# Altium project loz-old-man.PrjPcb (part 1 of 5)
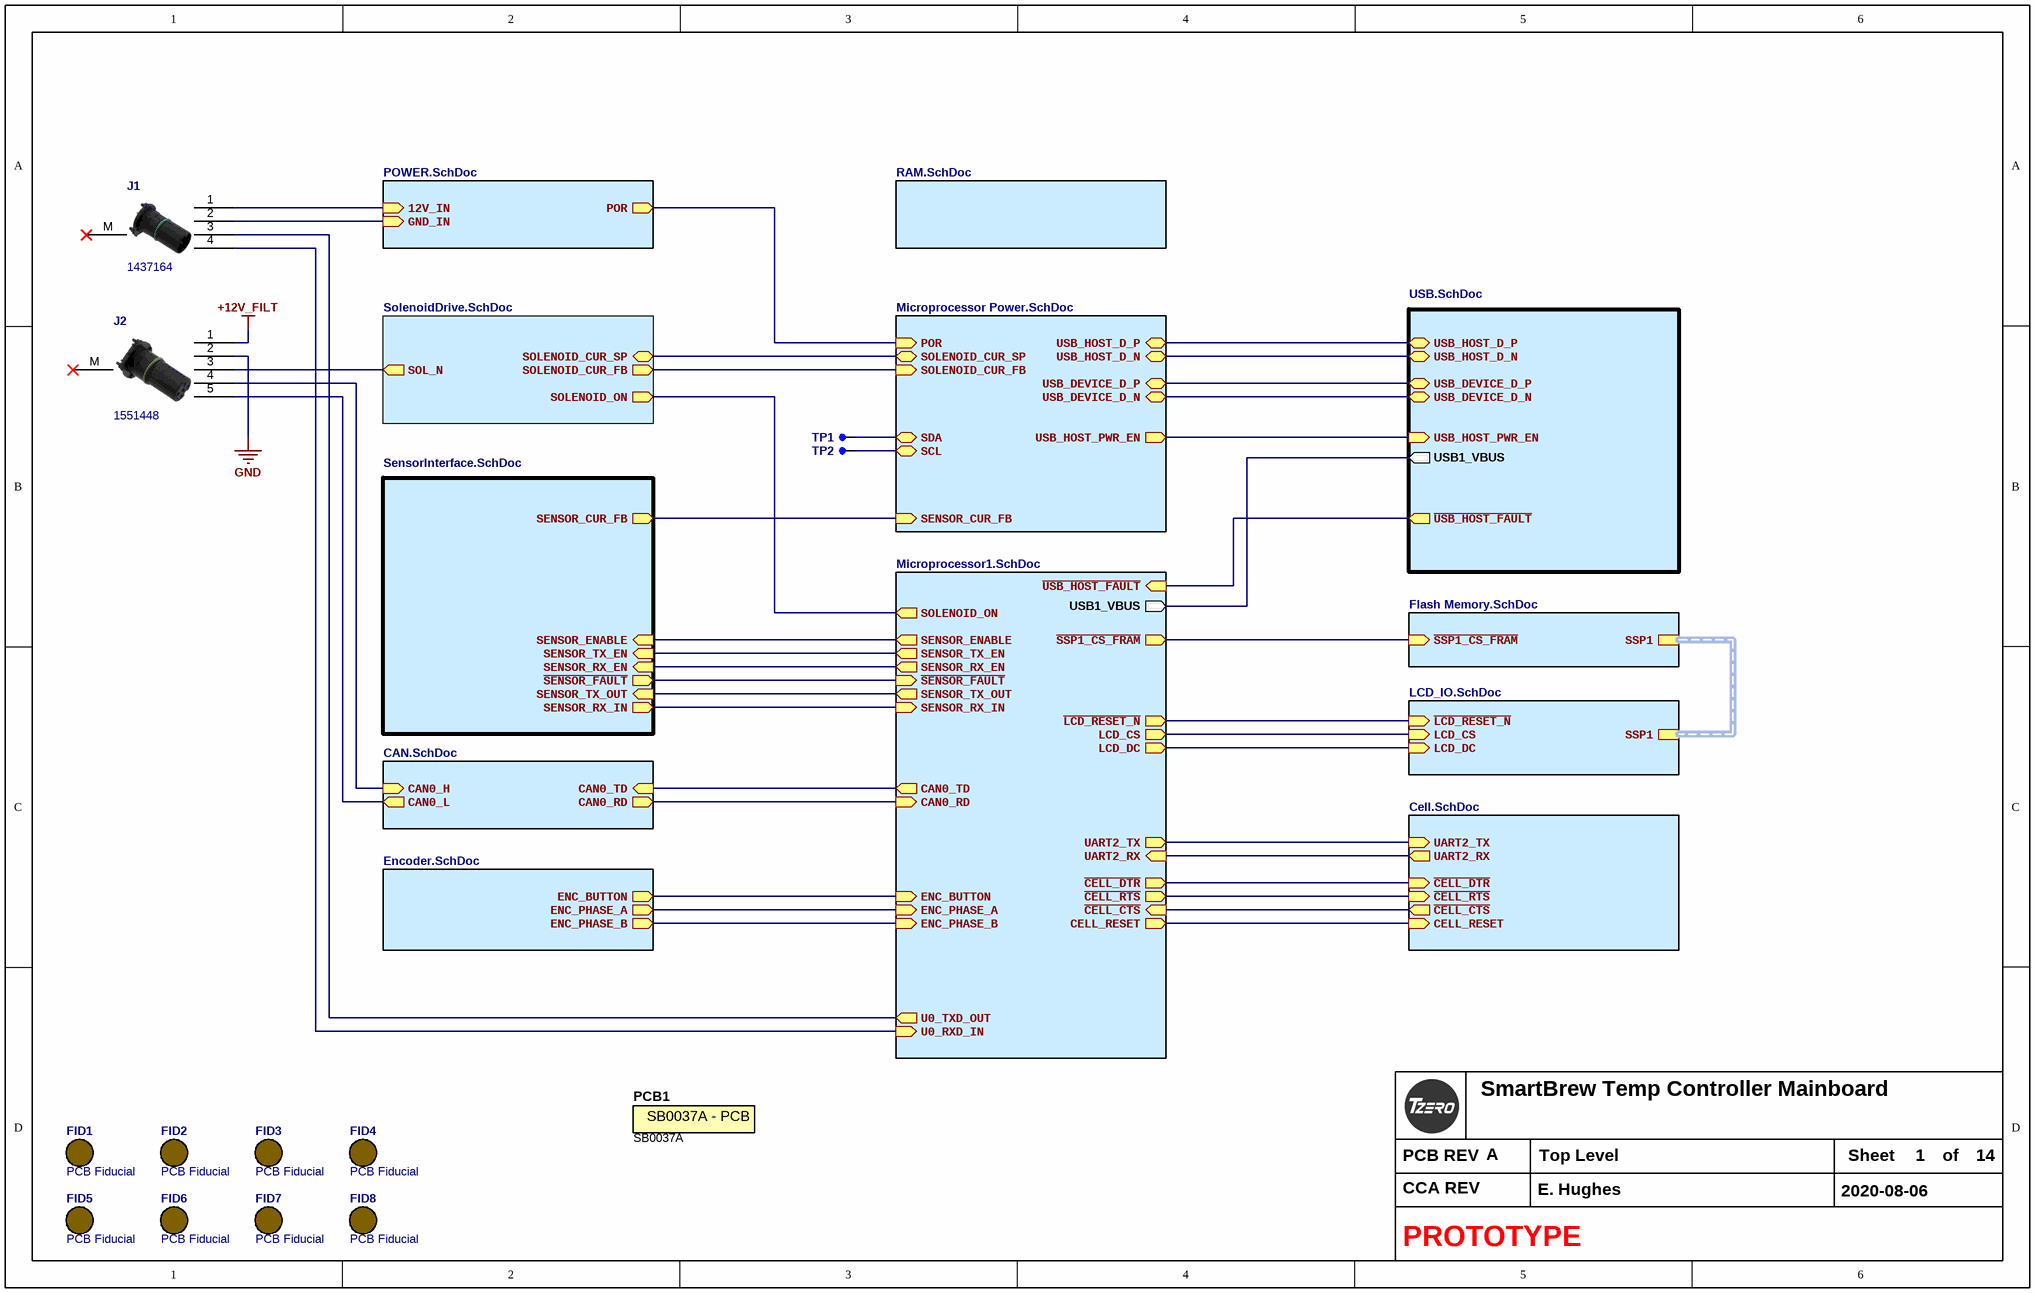
[diagram p0: TOP_LEVEL.SchDoc]
APPROVAL_APPROVED_1: -; APPROVAL_APPROVED_1_DATE: -; APPROVAL_APPROVED_2: -; APPROVAL_APPROVED_2_DATE: -; APPROVAL_CHECKED_DATE: -; APPROVAL_DRAWN: -; APPROVAL_DRAWN_DATE: -; APPROVAL_ENGINEER: -; APPROVAL_ENGINEER_DATE: -; APPROVAL_REVIEWED: -; APPROVAL_REVIEWED_DATE: -; BOM_NOTES_LINE_1: -; BOM_NOTES_LINE_2: -; BOM_NOTES_LINE_3: -; BOM_NOTES_LINE_4: -; CCA_PART_NUMBER: SB0036; CCA_TITLE: SmartBrew Temp Controller Mainboard; PCB_COPPER_WEIGHT_INNER: 1 oz; PCB_COPPER_WEIGHT_OUTER: 1 oz; PCB_DIMENSION_X: X; PCB_DIMENSION_Y: X; PCB_DRC_DATE: X; PCB_FINISH_PLATING: GOLD ENIG; PCB_FINISHED_THICKNESS: 62.5mil; PCB_LAYERS: 4; PCB_MATERIAL: FR4; PCB_MIN_DRILL: 10mil; PCB_MIN_TRACE_SPACE: 6mil; PCB_MIN_TRACE_WIDTH: 6mil; PCB_PART_NUMBER: SB0037; PCB_PRINTOUT_SCALE: 1:1; PCB_SILKSCREEN_COLOR_BOTTOM: WHITE; PCB_SILKSCREEN_COLOR_TOP: WHITE; PCB_SOLDER_MASK_COLOR_BOTTOM: BLUE; PCB_SOLDER_MASK_COLOR_TOP: BLUE; PCB_TITLE: SmartBrew Temp Controller Mainboard; PCB_VERSION: A; PROJECT_ENGINEER: E. Hughes; PROJECT_STATUS: PROTOTYPE; PROJECT_TITLE_LINE_1: SmartBrew Temp Controller Mainboard; SCH_DATE: 2020-08-06
13 sheets, 283 parts. Net scope: hierarchical (ports join the sheet entries above them; power ports are global).
Board file: SB0037A.PcbDoc
Sheets:
  TOP_LEVEL.SchDoc
    U_SolenoidDrive = SolenoidDrive.SchDoc
    U_Cell = Cell.SchDoc
    U_LCD_IO = LCD_IO.SchDoc
    U_SensorInterface = SensorInterface.SchDoc
    U_Encoder = Encoder.SchDoc
    U_POWER = POWER.SchDoc
    U_RAM = RAM.SchDoc
    U_CAN = CAN.SchDoc
    U_Microprocessor1 = Microprocessor1.SchDoc
    U_Microprocessor Power = Microprocessor Power.SchDoc
    U_Flash Memory = Flash Memory.SchDoc
    U_USB = USB.SchDoc

## Sheet TOP_LEVEL.SchDoc
size B; DocumentNumber: 1; SheetNumber: 1; SheetTotal: 14; PAGE_TITLE: Top Level

### Parts
FID1  PCB Fiducial  [Fiducial 1mm - 2mm]  (no BOM)
FID2  PCB Fiducial  [Fiducial 1mm - 2mm]  (no BOM)
FID3  PCB Fiducial  [Fiducial 1mm - 2mm]  (no BOM)
FID4  PCB Fiducial  [Fiducial 1mm - 2mm]  (no BOM)
FID5  PCB Fiducial  [Fiducial 1mm - 2mm]  (no BOM)
FID6  PCB Fiducial  [Fiducial 1mm - 2mm]  (no BOM)
FID7  PCB Fiducial  [Fiducial 1mm - 2mm]  (no BOM)
FID8  PCB Fiducial  [Fiducial 1mm - 2mm]  (no BOM)
J1  1437164  [1437164]
J2  1551448  [1551448]
PCB1  SB0037A  (mechanical)
TP1  (no value)  [TP_SMT_25_MIL_ROUND]  (net tie, no BOM)
TP2  (no value)  [TP_SMT_25_MIL_ROUND]  (net tie, no BOM)

### Sub-sheets
U_CAN = CAN.SchDoc: CAN0_RD (out), CAN0_TD (in), CAN0_L (out), CAN0_H (in)
U_Cell = Cell.SchDoc: UART2_TX (in), CELL_RESET (in), UART2_RX (out), ~{CELL_DTR} (in), ~{CELL_RTS} (in), ~{CELL_CTS} (out)
U_Encoder = Encoder.SchDoc: ENC_BUTTON (out), ENC_PHASE_A (out), ENC_PHASE_B (out)
U_Flash Memory = Flash Memory.SchDoc: ~{SSP1_CS_FRAM} (in), SSP1 (harness SSP1)
U_LCD_IO = LCD_IO.SchDoc: SSP1 (harness SSP1), ~{LCD_RESET_N} (in), LCD_CS (in), LCD_DC (in)
U_Microprocessor1 = Microprocessor1.SchDoc: LCD_DC (out), SENSOR_RX_EN (out), SOLENOID_ON (out), ~{SENSOR_FAULT} (in), SENSOR_ENABLE (out), SENSOR_TX_EN (out), SENSOR_TX_OUT (out), CAN0_TD (out), UART2_TX (out), SENSOR_RX_IN (in), ~{LCD_RESET_N} (out), UART2_RX (in), LCD_CS (out), ~{SSP1_CS_FRAM} (out), CAN0_RD (in), ENC_PHASE_B (in), ENC_PHASE_A (in), ENC_BUTTON (in), CELL_RESET (out), ~{CELL_DTR} (out), ~{CELL_RTS} (out), ~{CELL_CTS} (in), ~{USB_HOST_FAULT} (in), U0_RXD_IN (in), U0_TXD_OUT (out), USB1_VBUS (out)
U_Microprocessor Power = Microprocessor Power.SchDoc: SOLENOID_CUR_SP (bidir), SOLENOID_CUR_FB (in), USB_HOST_PWR_EN (out), SCL (bidir), SDA (bidir), POR (in), USB_DEVICE_D_P (bidir), USB_HOST_D_P (bidir), USB_DEVICE_D_N (bidir), USB_HOST_D_N (bidir), SENSOR_CUR_FB (in)
U_POWER = POWER.SchDoc: POR (out), 12V_IN (in), GND_IN (in)
U_RAM = RAM.SchDoc: no entries
U_SensorInterface = SensorInterface.SchDoc: SENSOR_TX_EN (in), SENSOR_ENABLE (in), ~{SENSOR_FAULT} (out), SENSOR_RX_IN (out), SENSOR_TX_OUT (in), SENSOR_RX_EN (in), SENSOR_CUR_FB (out)
U_SolenoidDrive = SolenoidDrive.SchDoc: SOLENOID_ON (out), SOLENOID_CUR_FB (out), SOLENOID_CUR_SP (bidir), SOL_N (out)
U_USB = USB.SchDoc: USB_HOST_D_P (bidir), USB_HOST_D_N (bidir), ~{USB_HOST_FAULT} (out), USB_HOST_PWR_EN (in), USB_DEVICE_D_P (bidir), USB_DEVICE_D_N (bidir), USB1_VBUS (out)

### Nets
+12V_FILT: J2.1
GND: J2.2
12V_IN: J1.1 ; sheet U_POWER/12V_IN
~{CELL_CTS}: sheet U_Cell/~{CELL_CTS}, sheet U_Microprocessor1/~{CELL_CTS}
~{CELL_DTR}: sheet U_Cell/~{CELL_DTR}, sheet U_Microprocessor1/~{CELL_DTR}
~{CELL_RTS}: sheet U_Cell/~{CELL_RTS}, sheet U_Microprocessor1/~{CELL_RTS}
~{LCD_RESET_N}: sheet U_LCD_IO/~{LCD_RESET_N}, sheet U_Microprocessor1/~{LCD_RESET_N}
~{SENSOR_FAULT}: sheet U_SensorInterface/~{SENSOR_FAULT}, sheet U_Microprocessor1/~{SENSOR_FAULT}
~{SSP1_CS_FRAM}: sheet U_Microprocessor1/~{SSP1_CS_FRAM}, sheet U_Flash Memory/~{SSP1_CS_FRAM}
~{USB_HOST_FAULT}: sheet U_Microprocessor1/~{USB_HOST_FAULT}, sheet U_USB/~{USB_HOST_FAULT}
CAN0_H: J2.4 ; sheet U_CAN/CAN0_H
CAN0_L: J2.5 ; sheet U_CAN/CAN0_L
CAN0_RD: sheet U_CAN/CAN0_RD, sheet U_Microprocessor1/CAN0_RD
CAN0_TD: sheet U_CAN/CAN0_TD, sheet U_Microprocessor1/CAN0_TD
CELL_RESET: sheet U_Cell/CELL_RESET, sheet U_Microprocessor1/CELL_RESET
ENC_BUTTON: sheet U_Encoder/ENC_BUTTON, sheet U_Microprocessor1/ENC_BUTTON
ENC_PHASE_A: sheet U_Encoder/ENC_PHASE_A, sheet U_Microprocessor1/ENC_PHASE_A
ENC_PHASE_B: sheet U_Encoder/ENC_PHASE_B, sheet U_Microprocessor1/ENC_PHASE_B
GND_IN: J1.2 ; sheet U_POWER/GND_IN
LCD_CS: sheet U_LCD_IO/LCD_CS, sheet U_Microprocessor1/LCD_CS
LCD_DC: sheet U_LCD_IO/LCD_DC, sheet U_Microprocessor1/LCD_DC
POR: sheet U_POWER/POR, sheet U_Microprocessor Power/POR
SCL: TP2.1 ; sheet U_Microprocessor Power/SCL
SDA: TP1.1 ; sheet U_Microprocessor Power/SDA
SENSOR_CUR_FB: sheet U_SensorInterface/SENSOR_CUR_FB, sheet U_Microprocessor Power/SENSOR_CUR_FB
SENSOR_ENABLE: sheet U_SensorInterface/SENSOR_ENABLE, sheet U_Microprocessor1/SENSOR_ENABLE
SENSOR_RX_EN: sheet U_SensorInterface/SENSOR_RX_EN, sheet U_Microprocessor1/SENSOR_RX_EN
SENSOR_RX_IN: sheet U_SensorInterface/SENSOR_RX_IN, sheet U_Microprocessor1/SENSOR_RX_IN
SENSOR_TX_EN: sheet U_SensorInterface/SENSOR_TX_EN, sheet U_Microprocessor1/SENSOR_TX_EN
SENSOR_TX_OUT: sheet U_SensorInterface/SENSOR_TX_OUT, sheet U_Microprocessor1/SENSOR_TX_OUT
SOL_N: J2.3 ; sheet U_SolenoidDrive/SOL_N
SOLENOID_CUR_FB: sheet U_SolenoidDrive/SOLENOID_CUR_FB, sheet U_Microprocessor Power/SOLENOID_CUR_FB
SOLENOID_CUR_SP: sheet U_SolenoidDrive/SOLENOID_CUR_SP, sheet U_Microprocessor Power/SOLENOID_CUR_SP
SOLENOID_ON: sheet U_SolenoidDrive/SOLENOID_ON, sheet U_Microprocessor1/SOLENOID_ON
U0_RXD_IN: J1.4 ; sheet U_Microprocessor1/U0_RXD_IN
U0_TXD_OUT: J1.3 ; sheet U_Microprocessor1/U0_TXD_OUT
UART2_RX: sheet U_Cell/UART2_RX, sheet U_Microprocessor1/UART2_RX
UART2_TX: sheet U_Cell/UART2_TX, sheet U_Microprocessor1/UART2_TX
USB1_VBUS: sheet U_Microprocessor1/USB1_VBUS, sheet U_USB/USB1_VBUS
USB_DEVICE_D_N: sheet U_Microprocessor Power/USB_DEVICE_D_N, sheet U_USB/USB_DEVICE_D_N
USB_DEVICE_D_P: sheet U_Microprocessor Power/USB_DEVICE_D_P, sheet U_USB/USB_DEVICE_D_P
USB_HOST_D_N: sheet U_Microprocessor Power/USB_HOST_D_N, sheet U_USB/USB_HOST_D_N
USB_HOST_D_P: sheet U_Microprocessor Power/USB_HOST_D_P, sheet U_USB/USB_HOST_D_P
USB_HOST_PWR_EN: sheet U_Microprocessor Power/USB_HOST_PWR_EN, sheet U_USB/USB_HOST_PWR_EN

Not connected (* = marked no-connect by the designer): J1 M*; J2 M*

### Buses and harness runs
harness sheet U_Flash Memory/SSP1 = sheet U_LCD_IO/SSP1

### Notes on the sheet
- PCB REV
- Sheet
- of
- CCA REV
- (in symbol SB0037A) SB0037A - PCB

### Library data of the parts
FID1-FID8 = Fiducial: Value: PCB Fiducial
J1 = 1437164: Circular Metric Connectors SACC-CI-M12MS- 4CON-L180 THR; Manufacturer: Phoenix Contact; Current Rating: 4A; Voltage Rating: 250V; Number of Contacts: 4; Connector Type: Plug; Gender: Female; Strain Relief: No (Without); Number of Ports: 1; Thread Size: M12; Ratings: IP67,Waterproof,Dust Tight; Value: 1437164; Supplier 1: Digi-Key; Manufacturer Part Number: 1437164; Stock 1: 71; Pricing 1: 1=6.15000, 10=5.88500, 50=5.72500, 100=5.35040, 250=4.92240, 500=4.54784, 1000=4.33387, 2500=3.87875 (USD); RoHS: Yes; Mount: Through Hole; Contact Material: Brass; Contact Plating: Gold; Housing Material: Polyamide; Number of Terminals: 4; Min Operating Temperature: -25°C; Max Operating Temperature: 85°C; Packaging: Tray; Max Current Rating: 4A; Termination: Solder; Package Quantity: 60; Contact Gender: Male; Number of Positions: 4; Orientation: Straight; Fastening Type: Threaded; ComponentLink1URL: https://datasheet.ciiva.com/16136/1437164-16136065.pdf?src-supplier=Onlinecomponents.com; ComponentLink1Description: https://datasheet.ciiva.com/16136/1437164-16136065.pdf?src-supplier=Onlinecomponents.com; ComponentLink2URL: https://datasheet.ciiva.com/29256/586130-da-01-en-sens-akt-einbaust-4pol-1437164-60-st-29256645.pdf?src-supplier=Conrad; ComponentLink2Description: https://datasheet.ciiva.com/29256/586130-da-01-en-sens-akt-einbaust-4pol-1437164-60-st-29256645.pdf?src-supplier=Conrad; Supplier Part Number 1: 277-13184-ND
J2 = 1551448: Flush-type connector SACC-CI-M12FS-5CON-L180-THR 1551448 Phoenix Contact; Plating: Polyamide; Number of Positions: 5; Current Rating: 4A; Voltage Rating: 60V; Connector Type: Receptacle; Number of Ports: 1; Thread Size: M12; Ratings: IP67,Waterproof,Dust Tight; Value: 1551448; Supplier 1: Digi-Key; Supplier Part Number 1: 277-13414-ND; Manufacturer: Phoenix Contact; Manufacturer Part Number: 1551448; Stock: 70; Pricing: 1=8.12, 10=7.771, 50=7.5588, 100=7.0642, 250=6.4991, 500=6.0046, 1000=5.722, 2500=5.3688 (USD); RoHS: Yes; Mount: Through Hole; Weight: 0.123459oz; Contact Plating: Gold; Contact Material: Brass; Number of Terminals: 5; Min Operating Temperature: -25°C; Max Operating Temperature: 85°C; Packaging: Tray; Number of Contacts: 5; Contact Gender: Female; Termination: Solder; Package Quantity: 60; Fastening Type: Threaded; Orientation: Straight; Max Current Rating: 4A; Lead Free: Lead Free; ComponentLink1URL: https://datasheet.ciiva.com/618/1551448-618993.pdf?src-supplier=Digi-Key; ComponentLink1Description: https://datasheet.ciiva.com/618/1551448-618993.pdf?src-supplier=Digi-Key; ComponentLink2URL: https://datasheet.ciiva.com/24433/1551448-24433704.pdf?src-supplier=Onlinecomponents.com; ComponentLink2Description: https://datasheet.ciiva.com/24433/1551448-24433704.pdf?src-supplier=Onlinecomponents.com; ComponentLink3URL: https://datasheet.ciiva.com/29259/719975-da-01-en-sens-akt-einbaubuch-5pol-1551448-60-st-29259372.pdf?src-supplier=Conrad; ComponentLink3Description: https://datasheet.ciiva.com/29259/719975-da-01-en-sens-akt-einbaubuch-5pol-1551448-60-st-29259372.pdf?src-supplier=Conrad
PCB1 = SB0037A: SB0037 Temp Controller Raw PCB Rev A; Manufacturer: TZero; Manufacturer Part Number: SB0024B; Value: SB0037A
TP1 TP2 = TP SMT 25MIL: Sort Value: *; Category: *; CategorySort: *

## Sheet SolenoidDrive.SchDoc
size B; DocumentNumber: 3; SheetNumber: 3; SheetTotal: 14; PAGE_TITLE: -
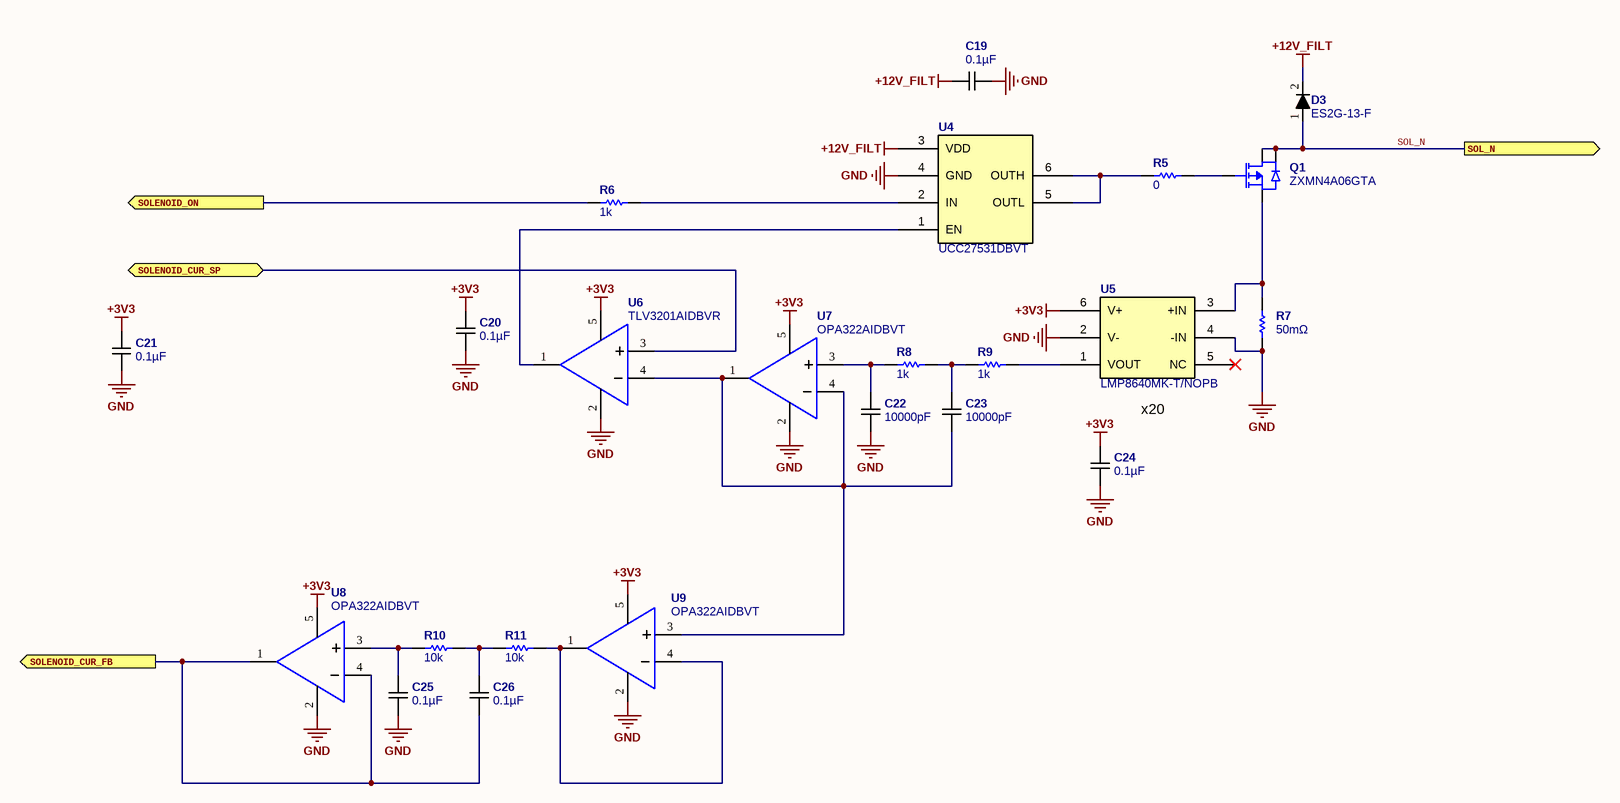
[diagram p1: SolenoidDrive.SchDoc]

### Parts
C19  0.1µF  [C0402_0.55MM_HD]
C20  0.1µF  [C0402_0.55MM_HD]
C21  0.1µF  [C0402_0.55MM_HD]
C22  10000pF  [C0603_0.90MM_HD]
C23  10000pF  [C0603_0.90MM_HD]
C24  0.1µF  [C0402_0.55MM_HD]
C25  0.1µF  [C0402_0.55MM_HD]
C26  0.1µF  [C0402_0.55MM_HD]
D3  ES2G-13-F  [D_SMB_P]
Q1  ZXMN4A06GTA  [SOT223]
R5  0  [R0603_0.55MM_MD]
R6  1k  [R0603_0.55MM_MD]
R7  50mΩ  [R1206_0.60MM_HD]
R8  1k  [R0603_0.55MM_MD]
R9  1k  [R0603_0.55MM_MD]
R10  10k  [R0603_0.55MM_MD]
R11  10k  [R0603_0.55MM_MD]
U4  UCC27531DBVT  [SOT95P245X145-6L]
U5  LMP8640MK-T/NOPB  [SOT95P245X145-6L]
U6  TLV3201AIDBVR  [SOT23-5]
U7  OPA322AIDBVT  [SOT23-5]
U8  OPA322AIDBVT  [SOT23-5]
U9  OPA322AIDBVT  [SOT23-5]

### Ports
SOL_N (out), SOLENOID_CUR_FB (out), SOLENOID_CUR_SP (bidir), SOLENOID_ON (out)

### Nets
+3V3: C20.1 C21.1 C24.1 U5.6(V+) U6.5(VCC) U7.5(VCC) U8.5(VCC) U9.5(VCC)
+12V_FILT: C19.1 D3.2(K) U4.3(VDD)
GND: C19.2 C20.2 C21.2 C22.1 C24.2 C25.2 R7.1 U4.4(GND) U5.2(V-) U5.4(-IN) U6.2(GND) U7.2(GND) U8.2(GND) U9.2(GND)
SOL_N: D3.1(A) Q1.2(D) Q1.4(D) ; port SOL_N
SOLENOID_CUR_FB: C26.2 U8.1(OUT) U8.4(-) ; port SOLENOID_CUR_FB
SOLENOID_CUR_SP: U6.3(+) ; port SOLENOID_CUR_SP
SOLENOID_ON: R6.1 ; port SOLENOID_ON
NetC22_2: C22.2 R8.2 U7.3(+)
NetC23_1: C23.1 U6.4(-) U7.1(OUT) U7.4(-) U9.3(+)
NetC23_2: C23.2 R8.1 R9.2
NetC25_1: C25.1 R10.2 U8.3(+)
NetC26_1: C26.1 R10.1 R11.2
NetQ1_1: Q1.1(G) R5.1
NetQ1_3: Q1.3(S) R7.2 U5.3(+IN)
NetR5_2: R5.2 U4.5(OUTL) U4.6(OUTH)
NetR6_2: R6.2 U4.2(IN)
NetR9_1: R9.1 U5.1(VOUT)
NetR11_1: R11.1 U9.1(OUT) U9.4(-)
NetU4_1: U4.1(EN) U6.1(OUT)

Not connected (* = marked no-connect by the designer): U5 5(NC)*

### Notes on the sheet
- x20
- PCB REV
- Sheet
- of
- CCA REV

### Library data of the parts
C19-C21 C24-C26 = CGA2B3X7R1E104K050BB: CAP CER 0.1UF 25V X7R 0402; Manufacturer: TDK Corporation; Tolerance: ±10%; Substitution Notes: 0.1µF , 25V , ±10% , X7R , -55°C ~ 125°C , AEC-Q200 , 0402; Value: 0.1µF; Temperature Coefficient: X7R; Manufacturer Part Number: CGA2B3X7R1E104K050BB; ComponentLink1Description: Datasheet (Internal); ComponentLink1URL: datasheets\TDK\mlcc_automotive_general_en.pdf; ComponentLink2Description: Datasheet (External); ComponentLink2URL: https://product.tdk.com/info/en/catalog/datasheets/mlcc_automotive_general_en.pdf; Supplier 1: Digikey; Supplier Part Number 1: 445-6902-1-ND; Category: Capacitors; Voltage - Rated: 25V; Features: -; Operating Temperature: -55°C ~ 125°C; Ratings: AEC-Q200; Package: 0402; Thickness (Max): 0.55MM
C22 C23 = CGA3E2C0G1H103J080AA: CAP CER 10000PF 50V C0G 0603; Manufacturer: TDK Corporation; Temperature Coefficient: C0G, NP0; Tolerance: ±5%; Substitution Notes: 10000pF , 50V , ±5% , C0G, NP0 , -55°C ~ 125°C , AEC-Q200 , 0603; Value: 10000pF; Manufacturer Part Number: CGA3E2C0G1H103J080AA; ComponentLink1Description: Datasheet (Internal); ComponentLink1URL: datasheets\TDK\mlcc_automotive_general_en.pdf; ComponentLink2Description: Datasheet (External); ComponentLink2URL: https://product.tdk.com/info/en/catalog/datasheets/mlcc_automotive_general_en.pdf; Supplier 1: Digikey; Supplier Part Number 1: 445-6916-1-ND; Category: Capacitors; Voltage - Rated: 50V; Features: -; Operating Temperature: -55°C ~ 125°C; Ratings: AEC-Q200; Package: 0603; Thickness (Max): 0.90MM
D3 = ES2G-13-F: DIODE SUPER FAST 2A 400V SMB; Manufacturer: Diodes Inc; CategorySort: 400; Diode Type: Standard; Voltage - Forward (Vf) (Max) @ If: 1.25V @ 2A; Speed: Fast Recovery =< 500ns- > 200mA (Io); Reverse Recovery Time (trr): 35ns; Current - Reverse Leakage @ Vr: 5µA @ 400V; Capacitance @ Vr- F: 25pF @ 4V- 1MHz; Num Pins: 2; Diode Suffix: 1A_2C; Category: Diodes; Value: ES2G-13-F; Manufacturer Part Number: ES2G-13-F; ComponentLink1Description: Internal Datasheet; ComponentLink1URL: http://www.diodes.com/datasheets/ds30212.pdf; ComponentLink2Description: External Datasheet; ComponentLink2URL: http://www.diodes.com/datasheets/ds30212.pdf; Supplier 1: Digi-Key; Supplier Part Number 1: ES2G-FDICT-ND; SortValue: ES2G-13-F; Voltage - DC Reverse (Vr) (Max): 400V; Current - Average Rectified (Io): 2A; Mounting Type: Surface Mount; Package: DO-214AA- SMB; Supplier Device Package: SMB; Packaging: Cut Tape (CT)
Q1 = ZXMN4A06GTA: Trans MOSFET N-CH 40V 7A 4-Pin(3+Tab) SOT-223 T/R; Manufacturer: Diodes Zetex; Rise Time: 4.45ns; Gate to Source Voltage (Vgs): 20V; Fall Time: 7.35ns; Turn-Off Delay Time: 28.61ns; Turn-On Delay Time: 2.55ns; Max Power Dissipation: 3.9W; Rds On Max: 50mR; Input Capacitance: 770pF; Number of Elements: 1; Drain to Source Resistance: 75mR; Threshold Voltage: 1V; Element Configuration: Single; Current Rating: 6.7A; Value: ZXMN4A06GTA; Supplier 1: Digi-Key; Manufacturer Part Number: ZXMN4A06GTA; Stock 1: 50125; Pricing 1: 1=0.84000, 10=0.73900, 100=0.50380, 500=0.42096 (USD); RoHS: Yes; Mount: Surface Mount; Case/Package: SOT-223; Number of Pins: 4; Weight: 0.000282oz; Min Operating Temperature: -55°C; Max Operating Temperature: 150°C; Continuous Drain Current (ID): 7A; Packaging: Tape and Reel; Package Quantity: 1000; Drain to Source Voltage (Vdss): 40V; Drain to Source Breakdown Voltage: 40V; Power Dissipation: 3.9W; Voltage Rating (DC): 40V; Number of Channels: 1; On-State Resistance: 75mR; Length: 6.7mm; Height: 1.65mm; Width: 3.7mm; Radiation Hardening: No; REACH SVHC: No SVHC; Lead Free: Lead Free; ComponentLink1URL: https://datasheet.ciiva.com/16509/zxmn4a06g-16509072.pdf?src-supplier=Future+Electronics; ComponentLink1Description: https://datasheet.ciiva.com/16509/zxmn4a06g-16509072.pdf?src-supplier=Future+Electronics; ComponentLink2URL: https://datasheet.ciiva.com/11176/zxmn4a06g-11176340.pdf?src-supplier=Avnet; ComponentLink2Description: https://datasheet.ciiva.com/11176/zxmn4a06g-11176340.pdf?src-supplier=Avnet; ComponentLink3URL: https://datasheet.ciiva.com/26816/getdatasheetpartid-86229-26816612.pdf?src-supplier=Verical; ComponentLink3Description: https://datasheet.ciiva.com/26816/getdatasheetpartid-86229-26816612.pdf?src-supplier=Verical; ComponentLink4URL: https://datasheet.ciiva.com/5775/44098-5775224.pdf?src-supplier=Farnell; ComponentLink4Description: https://datasheet.ciiva.com/5775/44098-5775224.pdf?src-supplier=Farnell; ComponentLink5URL: https://datasheet.ciiva.com/11174/zxmn4a06g-11174983.pdf?src-supplier=Avnet; ComponentLink5Description: https://datasheet.ciiva.com/11174/zxmn4a06g-11174983.pdf?src-supplier=Avnet; Supplier Part Number 1: ZXMN4A06GCT-ND
R5 = ERJ-3GEY0R00V: RES 0.0 OHM 1/10W JUMP 0603 SMD; Manufacturer: Panasonic Electronic Components; Package Power: 0603  (0.1W); Power (Watts): 0.1W- 1/10W; Tolerance: Jumper; Limiting Element Voltage: 75; Maximum Overload Voltage: 150; Maximum Working Voltage: 0.0V; Substitution Notes: 0 , Jumper , 0603 , AEC-Q200; Value: 0; Manufacturer Part Number: ERJ-3GEY0R00V; ComponentLink1Description: Internal Datasheet; ComponentLink1URL: datasheets\Panasonic Electronic Components\AOA0000CE1.pdf; ComponentLink2Description: External Datasheet; ComponentLink2URL: http://industrial.panasonic.com/www-data/pdf/AOA0000/AOA0000CE1.pdf; Supplier 1: Digi-Key; Supplier Part Number 1: P0.0GCT-ND; Category: Resistors; Resistance (Ohms): 0; Composition: Thick Film; Features: -; Temperature Coefficient: -; Package: 0603 (1608 Metric); Supplier Package: 0603; Size / Dimension: 0.063" L x 0.031" W (1.60mm x 0.80mm); Height: 0.55MM; Number of Terminations: 2; Sort Value: 0; Sort Value Package: 603_0; Ratings: AEC-Q200
R6 R8 R9 = ERJ-3EKF1001V: RES 1K OHM 1/10W 1% 0603 SMD; Manufacturer: Panasonic Electronic Components; Package Power: 0603  (0.1W); Power (Watts): 0.1W- 1/10W; Temperature Coefficient: ±100ppm/°C; Limiting Element Voltage: 75; Maximum Overload Voltage: 150; Maximum Working Voltage: 10.0V; Substitution Notes: 1k , ±1% , 0603 , AEC-Q200; Value: 1k; Manufacturer Part Number: ERJ-3EKF1001V; ComponentLink1Description: Internal Datasheet; ComponentLink1URL: datasheets\Panasonic Electronic Components\AOA0000CE2.pdf; ComponentLink2Description: External Datasheet; ComponentLink2URL: http://industrial.panasonic.com/www-data/pdf/AOA0000/AOA0000CE2.pdf; Supplier 1: Digi-Key; Supplier Part Number 1: P1.00KHCT-ND; Category: Resistors; Resistance (Ohms): 1k; Composition: Thick Film; Features: -; Tolerance: ±1%; Package: 0603 (1608 Metric); Supplier Package: 0603; Size / Dimension: 0.063" L x 0.031" W (1.60mm x 0.80mm); Height: 0.55MM; Number of Terminations: 2; Packaging: Cut Tape (CT); Sort Value: 1000; Sort Value Package: 603_1000; Ratings: AEC-Q200
R7 = UR73V2BTTD50L0F: RES 0.05 OHM 1% 1/2W 1206; Manufacturer: KOA Speer Electronics, Inc.; Package Power: PACKAGE (POWER); Temperature Coefficient: ±75ppm/°C; Power (Watts): 0.5W, 1/2W; Substitution Notes: 50mΩ , 1206 , ±1% , ±75ppm/°C ,  0.5W, 1/2W , AEC-Q200; Value: 50mΩ; ComponentLink1Description: Datasheet (Internal); ComponentLink1URL: http://www.koaspeer.com/catimages/Products/UR73V/UR73V.pdf; ComponentLink2Description: Datasheet (External); ComponentLink2URL: http://www.koaspeer.com/catimages/Products/UR73V/UR73V.pdf; Manufacturer Part Number: UR73V2BTTD50L0F; Supplier 1: Digikey; Supplier Part Number 1: 2019-UR73V2BTTD50L0FTR-ND; Category: Resistors; Tolerance: ±1%; Operating Temperature: -55°C ~ 155°C; Ratings: AEC-Q200; Package: 1206; Thickness (Max): 0.60MM; Manufacturer 1: KOA Speer Electronics, Inc.; Manufacturer Part Number 1: UR73V2BTTD50L0F
R10 R11 = ERJ-3EKF1002V: RES 10K OHM 1/10W 1% 0603 SMD; Manufacturer: Panasonic Electronic Components; Package Power: 0603  (0.1W); Power (Watts): 0.1W- 1/10W; Temperature Coefficient: ±100ppm/°C; Limiting Element Voltage: 75; Maximum Overload Voltage: 150; Maximum Working Voltage: 31.6V; Substitution Notes: 10k , ±1% , 0603 , AEC-Q200; Value: 10k; Manufacturer Part Number: ERJ-3EKF1002V; ComponentLink1Description: Internal Datasheet; ComponentLink1URL: datasheets\Panasonic Electronic Components\AOA0000CE2.pdf; ComponentLink2Description: External Datasheet; ComponentLink2URL: http://industrial.panasonic.com/www-data/pdf/AOA0000/AOA0000CE2.pdf; Supplier 1: Digi-Key; Supplier Part Number 1: P10.0KHCT-ND; Category: Resistors; Resistance (Ohms): 10k; Composition: Thick Film; Features: -; Tolerance: ±1%; Package: 0603 (1608 Metric); Supplier Package: 0603; Size / Dimension: 0.063" L x 0.031" W (1.60mm x 0.80mm); Height: 0.55MM; Number of Terminations: 2; Packaging: Cut Tape (CT); Sort Value: 10000; Sort Value Package: 603_10000; Ratings: AEC-Q200
U4 = UCC27531DBVT: IC GATE DRVR IGBT/MOSFET SOT23-6; Manufacturer: Texas Instruments; Driven Configuration: High-Side or Low-Side; Channel Type: Single; Gate Type: IGBT, N-Channel MOSFET; Voltage - Supply: 10 V ~ 32 V; Logic Voltage - VIL, VIH: 1.2V, 2.2V; Current - Peak Output (Source, Sink): 2.5A, 5A; Input Type: Non-Inverting; Rise / Fall Time (Typ): 15ns, 7ns; Value: UCC27531DBVT; Supplier 1: Digi-Key; Supplier Part Number 1: 296-35613-1-ND; Manufacturer Part Number: UCC27531DBVT; RoHS: RoHS Compliant; Category: Integrated Circuits (ICs); Stock 1: 1544; Pricing 1: 1=2.36, 10=2.121, 100=1.7047 (USD); Packaging: Cut Tape (CT); Part Status: Active; Operating Temperature: -40°C ~ 140°C (TJ); Mounting Type: Surface Mount; Package / Case: SOT-23-6; Supplier Device Package: SOT-23-6; ComponentLink1URL: http://www.ti.com/lit/ds/symlink/ucc27531.pdf; ComponentLink1Description: http://www.ti.com/lit/ds/symlink/ucc27531.pdf
U5 = LMP8640MK-T/NOPB: IC OPAMP CURR SENSE 6SOT; Manufacturer: TI National Semiconductor; Slew Rate: 1.8V/µs; Input Bias Current: 13uA; Input Offset Voltage (Vos): 900uV; Common Mode Rejection Ratio: 60dB; Max Supply Voltage: 12V; Min Supply Voltage: 2.7V; Number of Circuits: 1; Gain Bandwidth Product: 950kHz; Operating Supply Current: 2.3mA; Power Supply Rejection Ratio (PSRR): 85dB; Voltage Gain: 26.02dB; Supplier 1: Digi-Key; Manufacturer Part Number: LMP8640MK-T/NOPB; Stock 1: 12296; Pricing 1: 1=2.01000, 10=1.80100, 25=1.69960, 100=1.35960, 250=1.18964, 500=1.15566 (USD); RoHS: Yes; Mount: Surface Mount; Case/Package: SOT-23-6; Number of Pins: 6; Weight: 0.00127oz; Contact Plating: Gold; Min Operating Temperature: -40°C; Max Operating Temperature: 125°C; Packaging: Tape and Reel; Package Quantity: 1; Number of Channels: 1; Number of Elements: 1; Number of Amplifiers: 1; Bandwidth: 950kHz; Radiation Hardening: No; Lead Free: Lead Free; REACH SVHC: No SVHC; ComponentLink1URL: https://datasheet.ciiva.com/2965/lmp8640-2965988.pdf?src-supplier=Avnet; ComponentLink1Description: https://datasheet.ciiva.com/2965/lmp8640-2965988.pdf?src-supplier=Avnet; ComponentLink2URL: https://datasheet.ciiva.com/1802/lmp8640-1802437.pdf?src-supplier=Digi-Key; ComponentLink2Description: https://datasheet.ciiva.com/1802/lmp8640-1802437.pdf?src-supplier=Digi-Key; ComponentLink3URL: https://datasheet.ciiva.com/1802/lmp8640-1802438.pdf?src-supplier=Digi-Key; ComponentLink3Description: https://datasheet.ciiva.com/1802/lmp8640-1802438.pdf?src-supplier=Digi-Key; ComponentLink4URL: https://datasheet.ciiva.com/1802/lmp8640-1802439.pdf?src-supplier=Digi-Key; ComponentLink4Description: https://datasheet.ciiva.com/1802/lmp8640-1802439.pdf?src-supplier=Digi-Key; Supplier Part Number 1: LMP8640MK-T/NOPBCT-ND; Value: LMP8640MK-T/NOPB
U6 = TLV3201AIDBVR: Single high speed, low power comparator 5-SOT-23 -40 to 125; Manufacturer: Texas Instruments; Max Supply Voltage: 5.5V; Min Supply Voltage: 2.7V; Number of Channels: 1; Nominal Supply Current: 50uA; Common Mode Rejection Ratio: 70dB; Propagation Delay: 50ns; Max Supply Current: 40uA; Input Bias Current: 5nA; Input Offset Voltage (Vos): 5mV; Response Time: 0.047us; Hysteresis: 1.2mV; Power Supply Rejection Ratio (PSRR): 85dB; Output Current: 21mA; Value: TLV3201AIDBVR; Supplier 1: Digi-Key; Supplier Part Number 1: 296-36750-1-ND; Manufacturer Part Number: TLV3201AIDBVR; Category: Comparators; Stock: 27179; Pricing: 1=1.36000, 10=1.21500, 25=1.15360, 100=0.88580, 250=0.78280, 500=0.74160, 1000=0.57680 (USD); Mount: Surface Mount; Case/Package: SOT-23-5; Number of Pins: 5; Contact Plating: Gold; Min Operating Temperature: -40°C; Max Operating Temperature: 125°C; Packaging: Tape and Reel; Package Quantity: 3000; Number of Elements: 1; Max Input Current: 5nA; Quiescent Current: 40uA; Type: General Purpose; Radiation Hardening: No; Lead Free: Lead Free; REACH SVHC: No SVHC; ComponentLink1URL: https://datasheet.ciiva.com/12286/sbos561a-203450-12286704.pdf?src-supplier=Mouser; ComponentLink1Description: https://datasheet.ciiva.com/12286/sbos561a-203450-12286704.pdf?src-supplier=Mouser; ComponentLink2URL: https://datasheet.ciiva.com/29634/tlv3201-29634998.pdf?src-supplier=Digi-Key; ComponentLink2Description: https://datasheet.ciiva.com/29634/tlv3201-29634998.pdf?src-supplier=Digi-Key; ComponentLink3URL: https://datasheet.ciiva.com/29634/tlv3201-29634999.pdf?src-supplier=Digi-Key; ComponentLink3Description: https://datasheet.ciiva.com/29634/tlv3201-29634999.pdf?src-supplier=Digi-Key; ComponentLink4URL: https://datasheet.ciiva.com/29635/tlv3201-29635000.pdf?src-supplier=Digi-Key; ComponentLink4Description: https://datasheet.ciiva.com/29635/tlv3201-29635000.pdf?src-supplier=Digi-Key; ComponentLink5URL: https://datasheet.ciiva.com/2966/tlv3202-2966810.pdf?src-supplier=Avnet; ComponentLink5Description: https://datasheet.ciiva.com/2966/tlv3202-2966810.pdf?src-supplier=Avnet; ComponentLink6URL: https://octopart.com/click/track?ai=8629&ct=datasheets&sig=0da13b1&at=physicalpart&sid=370&ppid=22616100&hlid=24934711&src-supplier=TI+store; ComponentLink6Description: https://octopart.com/click/track?ai=8629&ct=datasheets&sig=0da13b1&at=physicalpart&sid=370&ppid=22616100&hlid=24934711&src-supplier=TI+store; ComponentLink7URL: http://datasheet.octopart.com/TLV3201AIDBVR-Texas-Instruments-datasheet-37140356.pdf?src-supplier=Newark; ComponentLink7Description: http://datasheet.octopart.com/TLV3201AIDBVR-Texas-Instruments-datasheet-37140356.pdf?src-supplier=Newark; ComponentLink8URL: http://datasheet.octopart.com/TLV3201AIDBVR-Texas-Instruments-datasheet-10947357.pdf?src-supplier=TI+store; ComponentLink8Description: http://datasheet.octopart.com/TLV3201AIDBVR-Texas-Instruments-datasheet-10947357.pdf?src-supplier=TI+store; ComponentLink9URL: http://datasheet.octopart.com/TLV3201AIDBVR-Texas-Instruments-datasheet-11515870.pdf?src-supplier=TI+store; ComponentLink9Description: http://datasheet.octopart.com/TLV3201AIDBVR-Texas-Instruments-datasheet-11515870.pdf?src-supplier=TI+store; ComponentLink10URL: http://sigma.octopart.com/49249325/technical_drawing/Texas-Instruments-TLV3201AIDBVR.pdf?src-supplier=TI+store; ComponentLink10Description: http://sigma.octopart.com/49249325/technical_drawing/Texas-Instruments-TLV3201AIDBVR.pdf?src-supplier=TI+store; ComponentLink11URL: http://sigma.octopart.com/102331370/technical_drawing/Texas-Instruments-TLV3201AIDBVR.pdf?src-supplier=TI+store; ComponentLink11Description: http://sigma.octopart.com/102331370/technical_drawing/Texas-Instruments-TLV3201AIDBVR.pdf?src-supplier=TI+store; ComponentLink12URL: http://datasheet.octopart.com/TLV3201AIDBVR-Texas-Instruments-datasheet-103689170.pdf?src-supplier=Newark; ComponentLink12Description: http://datasheet.octopart.com/TLV3201AIDBVR-Texas-Instruments-datasheet-103689170.pdf?src-supplier=Newark; ComponentLink13URL: http://datasheet.octopart.com/TLV3201AIDBVR-Texas-Instruments-datasheet-81455961.pdf?src-supplier=TME; ComponentLink13Description: http://datasheet.octopart.com/TLV3201AIDBVR-Texas-Instruments-datasheet-81455961.pdf?src-supplier=TME
U7-U9 = OPA322AIDBVT: IC OPAMP GP 20MHZ RRO SOT23-5; Manufacturer: Texas Instruments; Number of Channels: 1; Min Supply Voltage: 1.8V; Max Supply Voltage: 5.5V; Slew Rate: 10V/µs; Input Bias Current: 10pA; Input Offset Voltage (Vos): 2mV; Voltage Gain: 130dB; Common Mode Rejection Ratio: 90dB; Operating Supply Current: 1.6mA; Nominal Supply Current: 1.5mA; Output Current per Channel: 65mA; Min Dual Supply Voltage: 900mV; Max Dual Supply Voltage: 2.75V; Power Supply Rejection Ratio (PSRR): 100dB; Max Frequency: 10MHz; Manufacturer Part Number: OPA322AIDBVT; Value: OPA322AIDBVT; Supplier 1: Digi-Key; Supplier Part Number 1: 296-29511-1-ND; RoHS: Yes; Category: Amplifiers - Op Amps, Buffer, Instrumentation; Stock: 3683; Pricing: 1=1.66000, 10=1.49500, 25=1.41000, 100=1.12800 (USD); Case/Package: SOT-23; Number of Pins: 5; Min Operating Temperature: -40°C; Max Operating Temperature: 125°C; Packaging: Tape and Reel; Package Quantity: 250; Number of Circuits: 1; Gain Bandwidth Product: 20MHz; Unity Gain Bandwidth Product: 20MHz; Number of Elements: 1; Max I/O Voltage: 2mV; Nominal Gain Bandwidth Product: 20MHz; Output Current: 65mA; Bandwidth: 20MHz; Number of Amplifiers: 1; Operating Supply Voltage: 2.75V; Length: 3.05mm; Height: 1.3mm; Width: 1.75mm; Radiation Hardening: No; Lead Free: Lead Free; REACH SVHC: No SVHC; ComponentLink1URL: https://datasheet.ciiva.com/1803/opa322-1803459.pdf?src-supplier=Digi-Key; ComponentLink1Description: https://datasheet.ciiva.com/1803/opa322-1803459.pdf?src-supplier=Digi-Key; ComponentLink2URL: https://datasheet.ciiva.com/7848/1481239-7848179.pdf?src-supplier=Element14; ComponentLink2Description: https://datasheet.ciiva.com/7848/1481239-7848179.pdf?src-supplier=Element14; ComponentLink3URL: https://datasheet.ciiva.com/1803/opa322-1803460.pdf?src-supplier=Digi-Key; ComponentLink3Description: https://datasheet.ciiva.com/1803/opa322-1803460.pdf?src-supplier=Digi-Key; ComponentLink4URL: https://datasheet.ciiva.com/1803/opa322-1803461.pdf?src-supplier=Digi-Key; ComponentLink4Description: https://datasheet.ciiva.com/1803/opa322-1803461.pdf?src-supplier=Digi-Key; ComponentLink5URL: https://datasheet.ciiva.com/14460/opa4322-14460092.pdf?src-supplier=Avnet; ComponentLink5Description: https://datasheet.ciiva.com/14460/opa4322-14460092.pdf?src-supplier=Avnet; ComponentLink6URL: https://datasheet.ciiva.com/48706/001071938-da-01-en-ic-opamp-gp-rr-opa322aidbvt-sot-23-5-tid-48706602.pdf?src-supplier=Conrad; ComponentLink6Description: https://datasheet.ciiva.com/48706/001071938-da-01-en-ic-opamp-gp-rr-opa322aidbvt-sot-23-5-tid-48706602.pdf?src-supplier=Conrad

## Sheet Cell.SchDoc
size B; DocumentNumber: 6; SheetNumber: 6; SheetTotal: 14; PAGE_TITLE: -
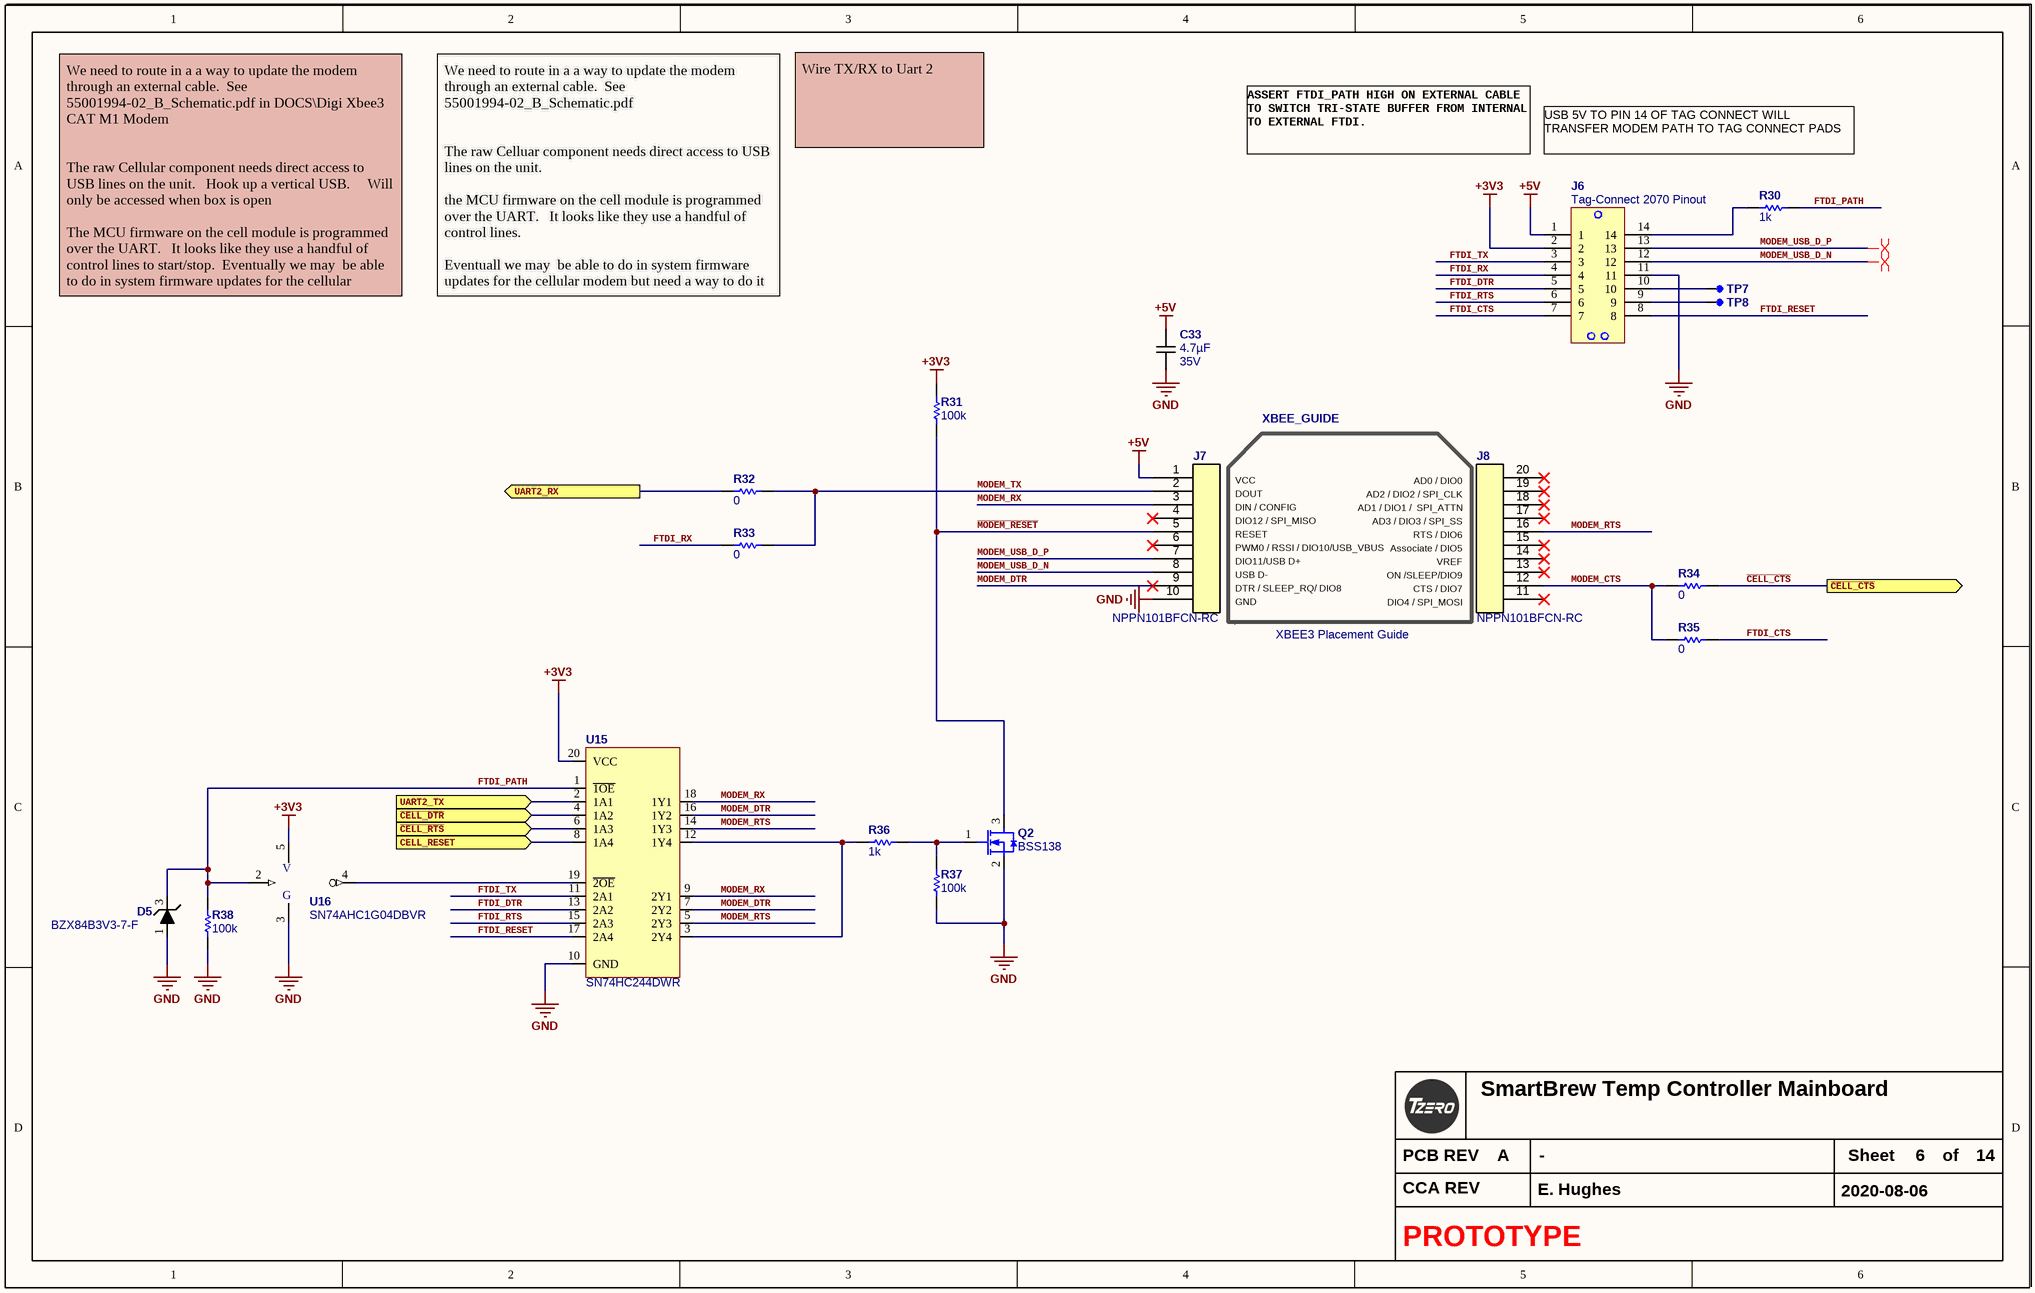
[diagram p2: Cell.SchDoc]

### Parts
C33  4.7µF  Voltage - Rated: 35V  [C0805_1.50MM_HD]
D5  BZX84B3V3-7-F  [D_SOT-23-3_P]
J6  Tag-Connect 2070 Pinout  [TC2070]  (no BOM)
J7  NPPN101BFCN-RC  [NPPN101BFCN-RC]
J8  NPPN101BFCN-RC  [NPPN101BFCN-RC - 11-20]
Q2  BSS138  [SOT23_Medium]
R30  1k  [R0603_0.55MM_MD]
R31  100k  [R0603_0.55MM_MD]
R32  0  [R0603_0.55MM_MD]
R33  0  [R0603_0.55MM_MD]
R34  0  [R0603_0.55MM_MD]
R35  0  [R0603_0.55MM_MD]
R36  1k  [R0603_0.55MM_MD]
R37  100k  [R0603_0.55MM_MD]
R38  100k  [R0603_0.55MM_MD]
TP7  (no value)  [TP_SMT_25_MIL_ROUND]  (net tie, no BOM)
TP8  (no value)  [TP_SMT_25_MIL_ROUND]  (net tie, no BOM)
U15  SN74HC244DWR  [SOIC-20-300_MEDIUM]
U16  SN74AHC1G04DBVR  [TSOT-23-5]
XBEE_GUIDE  XBEE3 Placement Guide  [XBEE3_CELLULAR_PLACEMENT_GUIDE]  (no BOM)

### Ports
CELL_RESET (in), UART2_RX (out), UART2_TX (in), ~{CELL_CTS} (out), ~{CELL_DTR} (in), ~{CELL_RTS} (in)

### Nets
+3V3: J6.2 R31.2 U15.20(VCC) U16.5(VCC)
+5V: C33.2 J6.1 J7.1
GND: C33.1 D5.1(A) J6.11 J7.10 Q2.2(S) R37.1 R38.1 U15.10(GND) U16.3(GND)
~{CELL_CTS}: R34.1 ; port ~{CELL_CTS}
~{CELL_DTR}: U15.4(1A2) ; port ~{CELL_DTR}
~{CELL_RTS}: U15.6(1A3) ; port ~{CELL_RTS}
~{MODEM_RESET}: J7.5 Q2.3(D) R31.1
CELL_RESET: U15.8(1A4) ; port CELL_RESET
FTDI_CTS: J6.7 R35.1
FTDI_DTR: J6.5 U15.13(2A2)
FTDI_PATH: D5.3(K) R30.1 R38.2 U15.1(~{1OE}) U16.2(A)
FTDI_RESET: J6.8 U15.17(2A4)
FTDI_RTS: J6.6 U15.15(2A3)
FTDI_RX: J6.4 R33.2
FTDI_TX: J6.3 U15.11(2A1)
MODEM_CTS: J8.12 R34.2 R35.2
MODEM_DTR: J7.9 U15.7(2Y2) U15.16(1Y2)
MODEM_RTS: J8.16 U15.5(2Y3) U15.14(1Y3)
MODEM_RX: J7.3 U15.9(2Y1) U15.18(1Y1)
MODEM_TX: J7.2 R32.1 R33.1
MODEM_USB_D_N: J6.12 J7.8
MODEM_USB_D_P: J6.13 J7.7
UART2_RX: R32.2 ; port UART2_RX
UART2_TX: U15.2(1A1) ; port UART2_TX
NetJ6_9: J6.9 TP8.1
NetJ6_10: J6.10 TP7.1
NetJ6_14: J6.14 R30.2
NetQ2_1: Q2.1(G) R36.1 R37.2
NetR36_2: R36.2 U15.3(2Y4) U15.12(1Y4)
NetU15_19: U15.19(~{2OE}) U16.4(Y)

Not connected (* = marked no-connect by the designer): J7 4* 6*; J8 11* 13* 14* 15* 17* 18* 19* 20*

### Layout directives
differential pair; differential pair class DIFF90: MODEM_USB_D_N, MODEM_USB_D_P

### Notes on the sheet
- Wire TX/RX to Uart 2
- ASSERT FTDI_PATH HIGH ON EXTERNAL CABLE TO SWITCH TRI-STATE BUFFER FROM INTERNAL TO EXTERNAL FTDI.
- USB 5V TO PIN 14 OF TAG CONNECT WILL TRANSFER MODEM PATH TO TAG CONNECT PADS
- We need to route in a a way to update the modem through an external cable.  See 55001994-02_B_Schematic.pdf in DOCS\Digi Xbee3 CAT M1 Modem
  The raw Cellular component needs direct access to USB lines on the unit.   Hook up a vertical USB.     Will only be accessed when box is open
  The MCU firmware on the cell module is programmed over the UART.   It looks like they use a handful of control lines to start/stop.  Eventually we may  be able to do in system firmware updates for the cellular modem but need a way to do it manually without pulling the modem out of the socket.   I would like to have some sort of "mux" that routes the UART and control signals to an external connector.    We could also put another FTDI chip on the PCB but it would rarely be used.    Can't use a stanard FTDI cable as we weel RTS,CTS and DTR.
- We need to route in a a way to update the modem through an external cable.  See 55001994-02_B_Schematic.pdf
  The raw Celluar component needs direct access to USB lines on the unit.
  the MCU firmware on the cell module is programmed over the UART.   It looks like they use a handful of control lines.
  Eventuall we may  be able to do in system firmware updates for the cellular modem but need a way to do it manually without pulling the modem out of the socket
- PCB REV
- Sheet
- of
- CCA REV
- (in symbol SN74AHC1G04DBVR) V; G
- (in symbol XBEE3_CELLULAR_PLACEMENT_GUIDE) AD0 / DIO0; VCC; AD2 / DIO2 / SPI_CLK; DOUT; AD1 / DIO1 /  SPI_ATTN; DIN / CONFIG; AD3 / DIO3 / SPI_SS; DIO12 / SPI_MISO; RTS / DIO6; RESET; Associate / DIO5; PWM0 / RSSI / DIO10/USB_VBUS; VREF; DIO11/USB D+; ON /SLEEP/DIO9; USB D-; CTS / DIO7; DTR / SLEEP_RQ/ DIO8; DIO4 / SPI_MOSI; GND

### Library data of the parts
C33 = CGA4J1X7R1V475K125AE: CAP CER 4.7UF 35V X7R 0805; Manufacturer: TDK Corporation; Tolerance: ±10%; Substitution Notes: 4.7µF , 35V , ±10% , X7R , -55°C ~ 125°C , AEC-Q200 , 0805; Value: 4.7µF; Temperature Coefficient: X7R; Manufacturer Part Number: CGA4J1X7R1V475K125AE; ComponentLink1Description: Datasheet (Internal); ComponentLink1URL: datasheets\TDK\mlcc_automotive_general_en.pdf; ComponentLink2Description: Datasheet (External); ComponentLink2URL: https://product.tdk.com/info/en/catalog/datasheets/mlcc_automotive_general_en.pdf; Supplier 1: Digikey; Supplier Part Number 1: 445-172479-1-ND; Category: Capacitors; Features: Soft Termination; Operating Temperature: -55°C ~ 125°C; Ratings: AEC-Q200; Package: 0805; Thickness (Max): 1.50MM
D5 = BZX84B3V3-7-F: DIODE ZENER 3.3V 300MW SOT23; Manufacturer: Diodes Inc; CategorySort: 400; Voltage - Forward (Vf) (Max) @ If: 900mV @ 10mA; Current - Reverse Leakage @ Vr: 5µA @ 1V; Tolerance: ±2%; Impedance (Max) (Zzt): 95 Ohm; Num Pins: 3; Diode Suffix: 1A_3C; Library Ref ARL: ARL_DZ_1A_3C; Category: Diodes; Value: BZX84B3V3-7-F; Manufacturer Part Number: BZX84B3V3-7-F; ComponentLink1Description: Internal Datasheet; ComponentLink1URL: http://www.diodes.com/datasheets/BZX84Bxx(x).pdf; ComponentLink2Description: External Datasheet; ComponentLink2URL: http://www.diodes.com/datasheets/BZX84Bxx(x).pdf; Stocked: 0; Supplier 1: Digi-Key; Supplier Part Number 1: BZX84B3V3-FDICT-ND; SortValue: BZX84B3V3-7-F; Pricing: 1 = 0.19  ;  10 = 0.177  ;  25 = 0.1612  ;  100 = 0.1159  ;  250 = 0.06824  ;  500 = 0.05662  ;  1000 = 0.03863 (USD); Sales Status: Active; Voltage - Zener (Nom) (Vz): 3.3V; Power - Max: 300mW; Mounting Type: Surface Mount; Package: TO-236-3- SC-59- SOT-23-3; Supplier Device Package: SOT-23-3; Packaging: Cut Tape (CT); Operating Temperature: -65°C ~ 150°C; MANUFACTURER_P_N: BZX84B3V3-7-F
J6 = TC2070
J7 = NPPN101BFCN-RC: CONN RECEPT 2MM SINGLE STR 10POS; Manufacturer: Sullins; Number of Positions: 10; Connector Type: Header,Socket; Current Rating: 1A; Gender: Female; Insulation Resistance: 5GR; Pitch: 0.079inch; Value: NPPN101BFCN-RC; Supplier 1: Digi-Key; Supplier Part Number 1: S5751-10-ND; Manufacturer Part Number: NPPN101BFCN-RC; RoHS: Yes; Stock: 72438; Pricing: 1 = 0.98000, 60 = 0.78033, 120 = 0.74650, 540 = 0.61074, 1020 = 0.54288, 5040 = 0.49010 (USD); Mount: Through Hole; Colour: Black; Contact Plating: Gold; Contact Material: Bronze; Material: Nylon; Min Operating Temperature: -40°C; Max Operating Temperature: 105°C; Package Quantity: 1000; Number of Rows: 1; Packaging: Bulk; Termination: Solder; Lead Free: Lead Free; ComponentLink1URL: https://drawings-pdf.s3.amazonaws.com/10483.pdf; ComponentLink1Description: https://drawings-pdf.s3.amazonaws.com/10483.pdf
J8 = NPPN101BFCN-RC_11-20: CONN RECEPT 2MM SINGLE STR 10POS; Manufacturer: Sullins; Number of Positions: 10; Connector Type: Header,Socket; Current Rating: 1A; Gender: Female; Insulation Resistance: 5GR; Pitch: 0.079inch; Value: NPPN101BFCN-RC; Supplier 1: Digi-Key; Supplier Part Number 1: S5751-10-ND; Manufacturer Part Number: NPPN101BFCN-RC; RoHS: Yes; Stock: 72438; Pricing: 1 = 0.98000, 60 = 0.78033, 120 = 0.74650, 540 = 0.61074, 1020 = 0.54288, 5040 = 0.49010 (USD); Mount: Through Hole; Colour: Black; Contact Plating: Gold; Contact Material: Bronze; Material: Nylon; Min Operating Temperature: -40°C; Max Operating Temperature: 105°C; Package Quantity: 1000; Number of Rows: 1; Packaging: Bulk; Termination: Solder; Lead Free: Lead Free; ComponentLink1URL: https://drawings-pdf.s3.amazonaws.com/10483.pdf; ComponentLink1Description: https://drawings-pdf.s3.amazonaws.com/10483.pdf
Q2 = BSS138: FAIRCHILD SEMICONDUCTOR - BSS138 - N CHANNEL MOSFET, 50V, 220mA SOT-23; CategorySort: 500; Value: BSS138; Sort Value: *; Category: Semiconductors; Supplier 1: Newark; Manufacturer: FAIRCHILD SEMICONDUCTOR; Manufacturer Part Number: BSS138; RoHS: YES; Stock 1: 17000; Pricing 1: 1=0.077, 25=0.064, 100=0.049, 250=0.039, 500=0.035, 1000=0.03 (USD); ComponentLink1URL: http://www.fairchildsemi.com/ds/BS/BSS138.pdf; ComponentLink1Description: http://www.fairchildsemi.com/ds/BS/BSS138.pdf; Supplier Part Number 1: 58K8769; Package: SOT-23
R30 R36 = ERJ-3EKF1001V: as R6 on sheet SolenoidDrive; Value: 1k; Manufacturer Part Number: ERJ-3EKF1001V; ComponentLink1Description: Internal Datasheet; ComponentLink1URL: datasheets\Panasonic Electronic Components\AOA0000CE2.pdf; ComponentLink2Description: External Datasheet; ComponentLink2URL: http://industrial.panasonic.com/www-data/pdf/AOA0000/AOA0000CE2.pdf; Supplier 1: Digi-Key; Supplier Part Number 1: P1.00KHCT-ND; Category: Resistors; Resistance (Ohms): 1k; Composition: Thick Film; Features: -; Tolerance: ±1%; Package: 0603 (1608 Metric); Supplier Package: 0603; Size / Dimension: 0.063" L x 0.031" W (1.60mm x 0.80mm); Height: 0.55MM; Number of Terminations: 2; Packaging: Cut Tape (CT); Sort Value: 1000; Sort Value Package: 603_1000; Ratings: AEC-Q200
R31 R37 R38 = ERJ-3EKF1003V: RES 100K OHM 1/10W 1% 0603 SMD; Manufacturer: Panasonic Electronic Components; Package Power: 0603  (0.1W); Power (Watts): 0.1W- 1/10W; Temperature Coefficient: ±100ppm/°C; Limiting Element Voltage: 75; Maximum Overload Voltage: 150; Maximum Working Voltage: 75.0V; Substitution Notes: 100k , ±1% , 0603 , AEC-Q200; Value: 100k; Manufacturer Part Number: ERJ-3EKF1003V; ComponentLink1Description: Internal Datasheet; ComponentLink1URL: datasheets\Panasonic Electronic Components\AOA0000CE2.pdf; ComponentLink2Description: External Datasheet; ComponentLink2URL: http://industrial.panasonic.com/www-data/pdf/AOA0000/AOA0000CE2.pdf; Supplier 1: Digi-Key; Supplier Part Number 1: P100KHCT-ND; Category: Resistors; Resistance (Ohms): 100k; Composition: Thick Film; Features: -; Tolerance: ±1%; Package: 0603 (1608 Metric); Supplier Package: 0603; Size / Dimension: 0.063" L x 0.031" W (1.60mm x 0.80mm); Height: 0.55MM; Number of Terminations: 2; Packaging: Cut Tape (CT); Sort Value: 100000; Sort Value Package: 603_100000; Ratings: AEC-Q200
R32-R35 = ERJ-3GEY0R00V: as R5 on sheet SolenoidDrive; Value: 0; Manufacturer Part Number: ERJ-3GEY0R00V; ComponentLink1Description: Internal Datasheet; ComponentLink1URL: datasheets\Panasonic Electronic Components\AOA0000CE1.pdf; ComponentLink2Description: External Datasheet; ComponentLink2URL: http://industrial.panasonic.com/www-data/pdf/AOA0000/AOA0000CE1.pdf; Supplier 1: Digi-Key; Supplier Part Number 1: P0.0GCT-ND; Category: Resistors; Resistance (Ohms): 0; Composition: Thick Film; Features: -; Temperature Coefficient: -; Package: 0603 (1608 Metric); Supplier Package: 0603; Size / Dimension: 0.063" L x 0.031" W (1.60mm x 0.80mm); Height: 0.55MM; Number of Terminations: 2; Sort Value: 0; Sort Value Package: 603_0; Ratings: AEC-Q200
TP7 TP8 = TP SMT 25MIL: Sort Value: *; Category: *; CategorySort: *
U15 = SN74HC244DWR: IC BUFF/DVR TRI-ST DUAL 20SOIC; Manufacturer: Texas Instruments; CategorySort: 600; Logic Type: Buffer/Line Driver, Non-Inverting; Number of Elements: 2; Number of Bits per Element: 4; Current - Output High, Low: 7.8mA, 7.8mA; Voltage - Supply: 2 V ~ 6 V; Value: SN74HC244DWR; Sort Value: *; Category: Integrated Circuits; Supplier 1: Digi-Key; Manufacturer Part Number: SN74HC244DWR; RoHS: RoHS Compliant; Stock 1: 40951; Pricing 1: 1=0.58, 25=0.4044, 100=0.3465, 250=0.29924, 500=0.25726, 1000=0.1995 (USD); Operating Temperature: -40°C ~ 85°C; Mounting Type: Surface Mount; Package: 20-SOIC (0.300", 7.50mm Width); Packaging: Cut Tape (CT); Supplier Device Package: 20-SOIC; ComponentLink1URL: http://focus.ti.com/lit/ds/symlink/sn74hc244.pdf; ComponentLink1Description: http://focus.ti.com/lit/ds/symlink/sn74hc244.pdf; Supplier Part Number 1: 296-1196-1-ND
U16 = SN74AHC1G04DBVR: IC SINGLE INVERTER GATE SOT23-5; Manufacturer: Texas Instruments; CategorySort: 600; Number of Inputs: 1; Current - Output High, Low: 8mA, 8mA; Voltage - Supply: 2 V ~ 5.5 V; Value: SN74AHC1G04DBVR; Sort Value: *; Category: Integrated Circuits; Supplier 1: Digi-Key; Supplier Part Number 1: 296-1089-1-ND; Manufacturer Part Number: SN74AHC1G04DBVR; RoHS: RoHS Compliant; Stock 1: 45111; Pricing 1: 1=0.53, 25=0.31, 100=0.25, 250=0.18, 500=0.145, 1000=0.1125 (USD); Logic Type: Inverter; Number of Circuits: 1; Operating Temperature: -40°C ~ 85°C; Mounting Type: Surface Mount; Package: SC-74A, SOT-753; Supplier Device Package: SOT-23-5; Packaging: Cut Tape (CT); ComponentLink1URL: http://focus.ti.com/lit/ds/symlink/sn74ahc1g04.pdf; ComponentLink1Description: http://focus.ti.com/lit/ds/symlink/sn74ahc1g04.pdf
XBEE_GUIDE = XBEE3_CELLULAR_PLACEMENT_GUIDE: Value: XBEE3 Placement Guide